# Altium schematic sheet Tacile-Buttons.SchDoc
size A; SheetNumber: 16; SheetTotal: 17
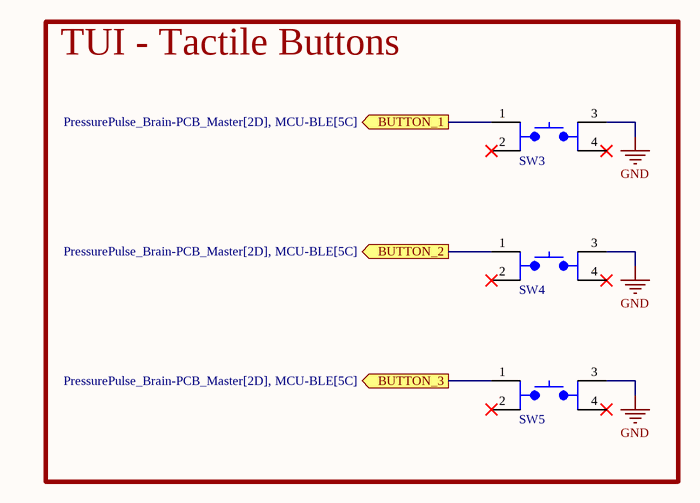
[diagram p0: Tacile-Buttons.SchDoc]

## Parts
SW3  SPDT SMT Tactile Push Button Switch  [TL6200]  (value not drawn)
SW4  SPDT SMT Tactile Push Button Switch  [TL6200]  (value not drawn)
SW5  SPDT SMT Tactile Push Button Switch  [TL6200]  (value not drawn)

## Blocks framed on the sheet
TUI - Tactile Buttons: SW3-SW5

## Ports
BUTTON_1 (out, see PressurePulse_Brain-PCB_Master[2D], MCU-BLE[5C]), BUTTON_2 (out, see PressurePulse_Brain-PCB_Master[2D], MCU-BLE[5C]), BUTTON_3 (out, see PressurePulse_Brain-PCB_Master[2D], MCU-BLE[5C])

## Nets
GND: SW3.3 SW4.3 SW5.3
BUTTON_1: SW3.1 ; port BUTTON_1
BUTTON_2: SW4.1 ; port BUTTON_2
BUTTON_3: SW5.1 ; port BUTTON_3

Not connected (* = marked no-connect by the designer): SW3 2* 4*; SW4 2* 4*; SW5 2* 4*

## Library data of the parts
SW3-SW5 = SPDT SMT Tactile Push Button Switch: Value: DNS; MFR: *; MFR PN: TL6200; JLCPCB PN: *